# Altium schematic sheet ArmDebuger(6-7)Port.SchDoc
size 393 x 241 mm
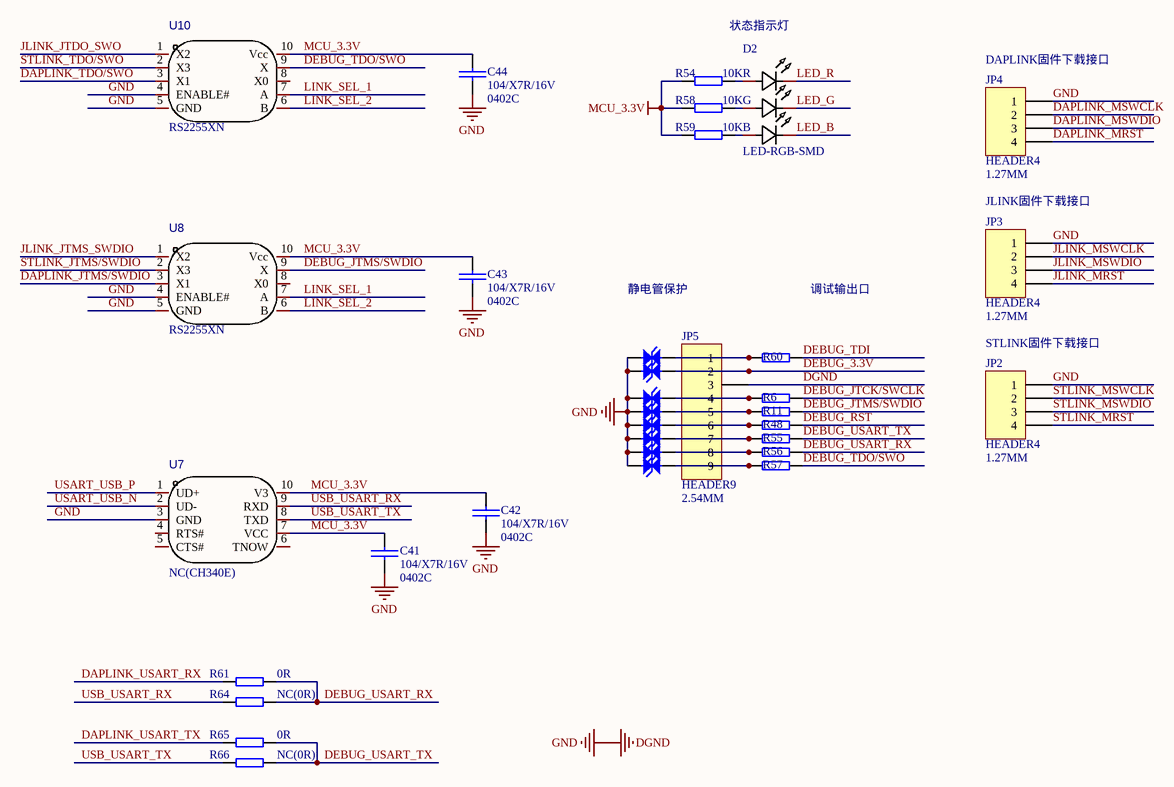
[diagram p0: ArmDebuger(6-7)Port.SchDoc]

## Parts
C41  104/X7R/16V  Fp: 0402C  [0402C-SMD-M]
C42  104/X7R/16V  Fp: 0402C  [0402C-SMD-M]
C43  104/X7R/16V  Fp: 0402C  [0402C-SMD-M]
C44  104/X7R/16V  Fp: 0402C  [0402C-SMD-M]
D2  LED-RGB-SMD  [LED-SMD-6P]
ED1  KESD3.3V52D-C  [SOD-523]  (value not drawn)
ED2  KESD3.3V52D-C  [SOD-523]  (value not drawn)
ED3  KESD3.3V52D-C  [SOD-523]  (value not drawn)
ED4  KESD3.3V52D-C  [SOD-523]  (value not drawn)
ED5  KESD3.3V52D-C  [SOD-523]  (value not drawn)
ED6  KESD3.3V52D-C  [SOD-523]  (value not drawn)
ED7  KESD3.3V52D-C  [SOD-523]  (value not drawn)
ED8  KESD3.3V52D-C  [SOD-523]  (value not drawn)
JP2  HEADER4  Fp: 1.27MM  [HDR-1X4-1.27MM]
JP3  HEADER4  Fp: 1.27MM  [HDR-1X4-1.27MM]
JP4  HEADER4  Fp: 1.27MM  [HDR-1X4-1.27MM]
JP5  HEADER9  Fp: 2.54MM  [Header-1x9]
R6  100R  [0402R-SMD-M]  (value not drawn)
R11  100R  [0402R-SMD-M]  (value not drawn)
R48  100R  [0402R-SMD-M]  (value not drawn)
R54  10K  [0402R-SMD-M]
R55  100R  [0402R-SMD-M]  (value not drawn)
R56  100R  [0402R-SMD-M]  (value not drawn)
R57  100R  [0402R-SMD-M]  (value not drawn)
R58  10K  [0402R-SMD-M]
R59  10K  [0402R-SMD-M]
R60  100R  [0402R-SMD-M]  (value not drawn)
R61  0R  [0402R-SMD-M]
R64  NC(0R)  [0402R-SMD-M]
R65  0R  [0402R-SMD-M]
R66  NC(0R)  [0402R-SMD-M]
U7  NC(CH340E)  [MSOP-10-L]
U8  RS2255XN  [MSOP-10-L]
U10  RS2255XN  [MSOP-10-L]

## Nets
DGND: C41.1 C42.1 C43.1 C44.1 ED1.2(K) ED2.2(K) ED3.2(K) ED4.2(K) ED5.2(K) ED6.2(K) ED7.2(K) ED8.2(K) JP2.1 JP3.1 JP4.1 JP5.3 U7.3(GND) U8.4(ENABLE#) U8.5(GND) U10.4(ENABLE#) U10.5(GND)  [also labelled GND]
MCU_3.3V: C41.2 C42.2 C43.2 C44.2 R54.1 R58.1 R59.1 U7.7(VCC) U7.10(V3) U8.10(Vcc) U10.10(Vcc)
DAPLINK_JTMS/SWDIO: U8.3(X1)
DAPLINK_MRST: JP4.4
DAPLINK_MSWCLK: JP4.2
DAPLINK_MSWDIO: JP4.3
DAPLINK_TDO/SWO: U10.3(X1)
DAPLINK_USART_RX: R61.2
DAPLINK_USART_TX: R65.2
DEBUG_3.3V: ED7.1(A) JP5.2
DEBUG_JTCK/SWCLK: R6.2
DEBUG_JTMS/SWDIO: R11.2 U8.9(X)
DEBUG_RST: R48.2
DEBUG_TDI: R60.2
DEBUG_TDO/SWO: R57.2 U10.9(X)
DEBUG_USART_RX: R56.2 R61.1 R64.1
DEBUG_USART_TX: R55.2 R65.1 R66.1
JLINK_JTDO_SWO: U10.1(X2)
JLINK_JTMS_SWDIO: U8.1(X2)
JLINK_MRST: JP3.4
JLINK_MSWCLK: JP3.2
JLINK_MSWDIO: JP3.3
LED_B: D2.4(-)
LED_G: D2.5(-)
LED_R: D2.6(-)
LINK_SEL_1: U8.7(A) U10.7(A)
LINK_SEL_2: U8.6(B) U10.6(B)
STLINK_JTMS/SWDIO: U8.2(X3)
STLINK_MRST: JP2.4
STLINK_MSWCLK: JP2.2
STLINK_MSWDIO: JP2.3
STLINK_TDO/SWO: U10.2(X3)
USART_USB_N: U7.2(UD-)
USART_USB_P: U7.1(UD+)
USB_USART_RX: R64.2 U7.9(RXD)
USB_USART_TX: R66.2 U7.8(TXD)
NetD2_1: D2.1(R) R54.2
NetD2_2: D2.2(G) R58.2
NetD2_3: D2.3(B) R59.2
NetED1_1: ED1.1(A) JP5.9 R57.1
NetED2_1: ED2.1(A) JP5.7 R55.1
NetED3_1: ED3.1(A) JP5.5 R11.1
NetED4_1: ED4.1(A) JP5.4 R6.1
NetED5_1: ED5.1(A) JP5.8 R56.1
NetED6_1: ED6.1(A) JP5.6 R48.1
NetED8_1: ED8.1(A) JP5.1 R60.1

Not connected (* = marked no-connect by the designer): U7 4(RTS#) 5(CTS#) 6(TNOW); U8 8(X0); U10 8(X0)

## Notes on the sheet
- 状态指示灯
- (near JP4) DAPLINK固件下载接口
- JLINK固件下载接口
- 静电管保护
- 调试输出口
- STLINK固件下载接口

## Library data of the parts
C41-C44 = CAP: P/N: 06075; LCSC: C60474
D2 = LED-RGB-SMD: Fp: SMD3535; LCSC: C784546; P/N: ?
ED1-ED8 = ESD: P/N: 02035; Fp: SOD-523; LCSC: C2892515
R6 R11 R48 R55-R57 R60 = RES: Fp: 0402R; P/N: 04154; LCSC: C106232
R54 R58 R59 = RES: Fp: 0402R; P/N: 04120; LCSC: C25744
R61 R65 = RES: Fp: 0402R; P/N: 04150; LCSC: C21376
R64 R66 = RES: Fp: 0402R; P/N: NC(04150); LCSC: NC
U7 = CH340E: Fp: MSOP-10; LCSC: NC; P/N: NC
U8 U10 = RS2255XN: Fp: MSOP-10; LCSC: C783421; P/N: ?
JP2-JP4 = HEADER4: LCSC: NC
JP5 = HEADER9: LCSC: NC